# EAGLE schematic 05B-001 (EAGLE 6.3)
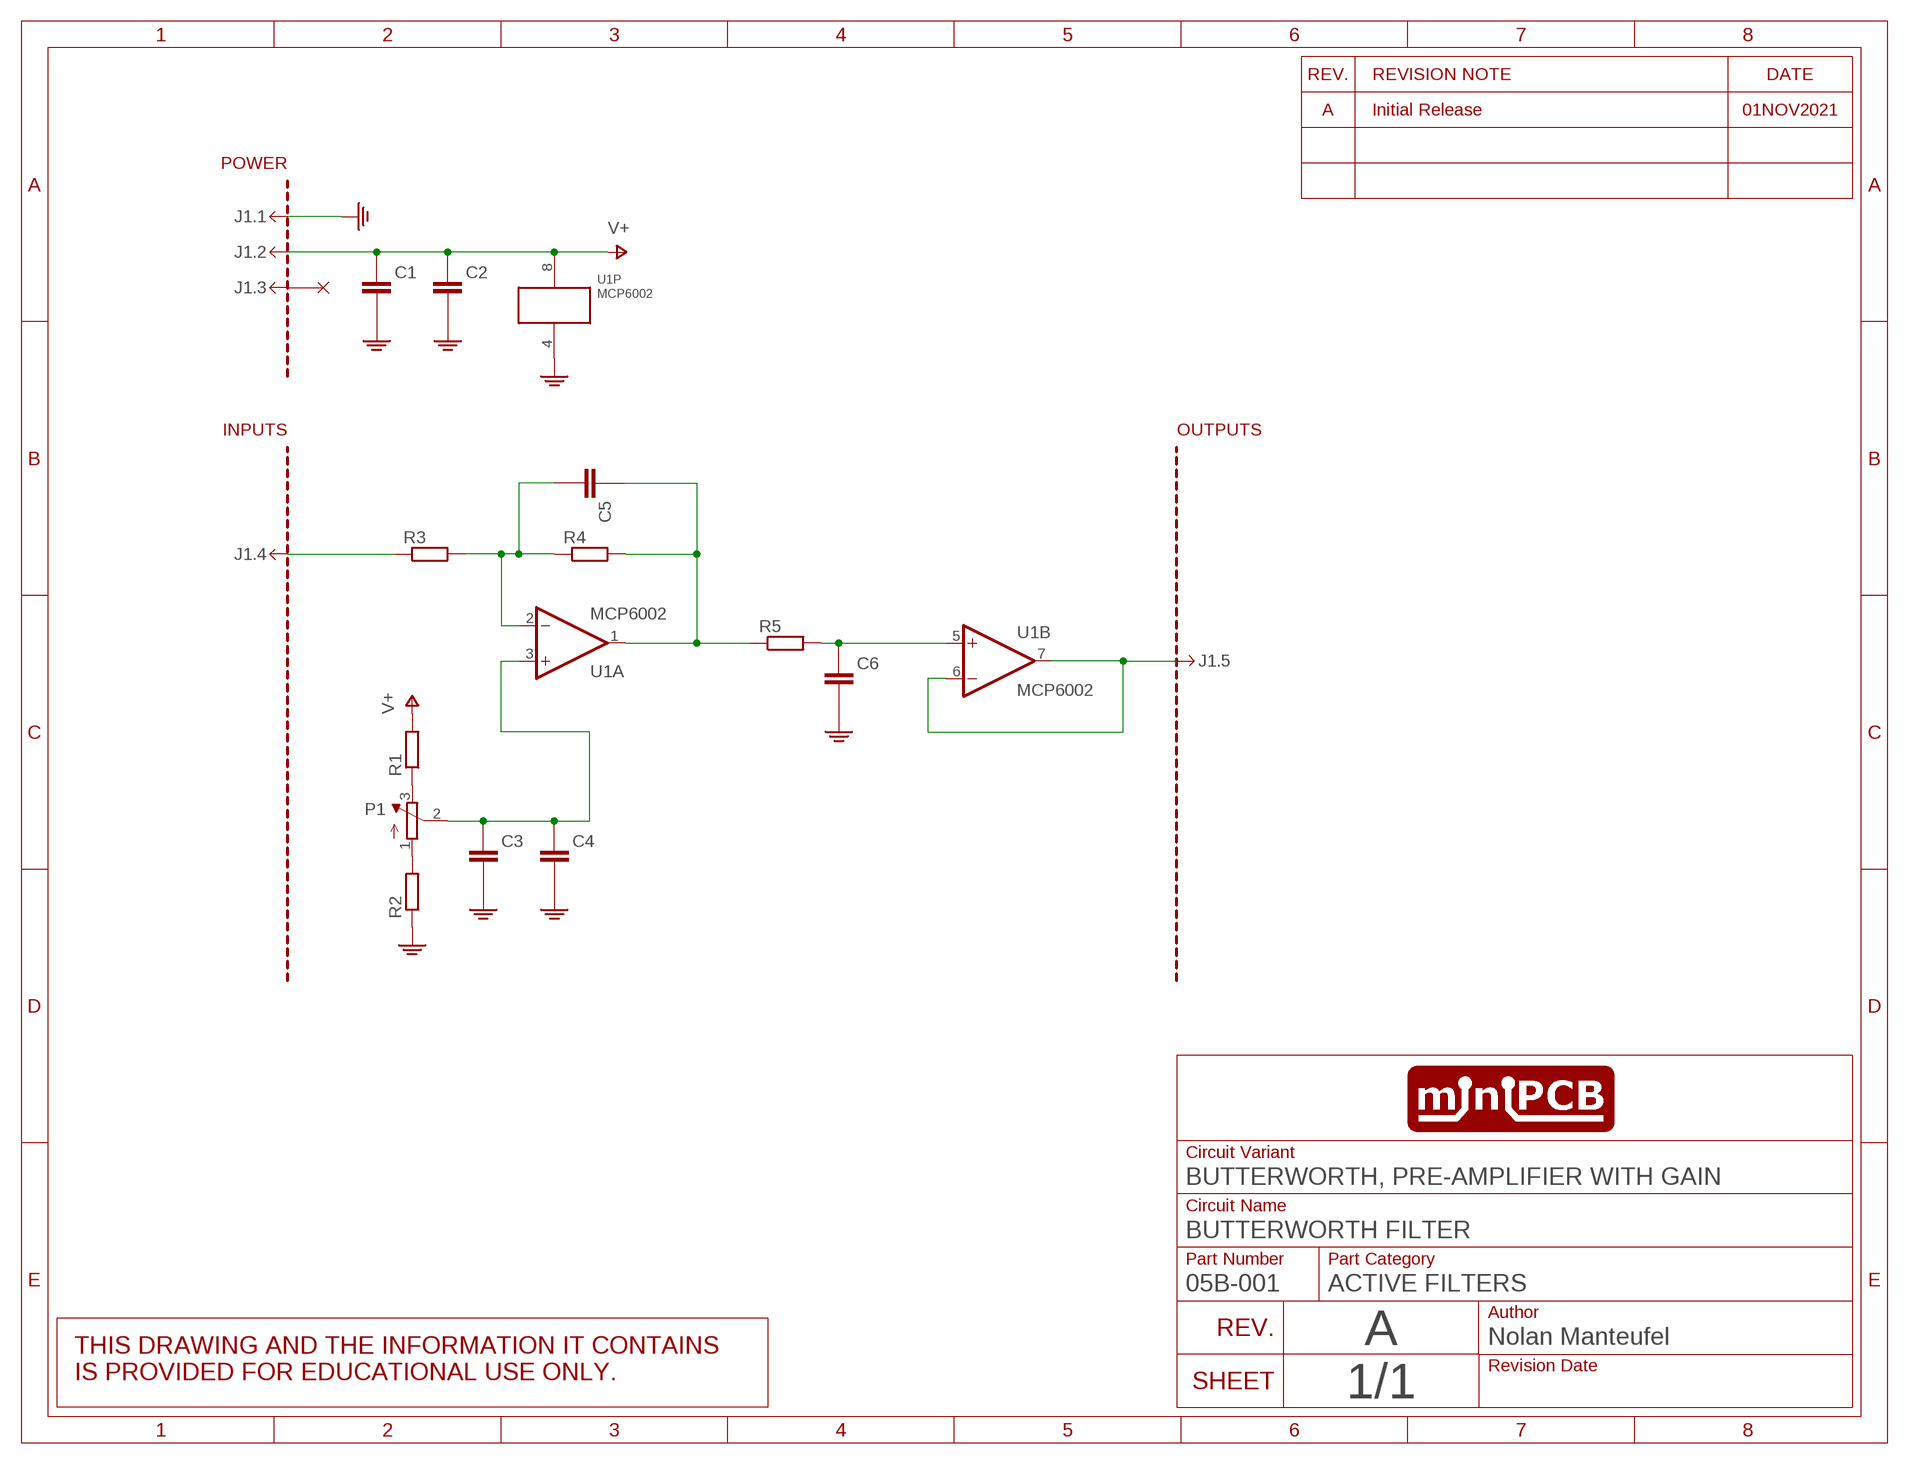
[diagram p0: schematic, sheet 1]
SHEET1 (SCHEMATIC): CIRCUIT_CATEGORY: ACTIVE FILTERS; CIRCUIT_NAME: BUTTERWORTH FILTER; REVISION: A

## Parts
C1  CAPACITORSMD  [C0805]
C2  CAPACITORSMD  [C0805]
C3  CAPACITORSMD  [C0805]
C4  CAPACITORSMD  [C0805]
C5  CAPACITORSMD  [C0805]
C6  CAPACITORSMD  [C0805]
J1.  MINIPCB_5P20X15  [MINIPCB_5P_20X15MM]
P1  TRIMPOT0.100THD  [TRIM_0100]
R1  RESISTORSMD  [R0805]
R2  RESISTORSMD  [R0805]
R3  RESISTORSMD  [R0805]
R4  RESISTORSMD  [R0805]
R5  RESISTORSMD  [R0805]
U1  MCP6002  OPAMP_DUALSMD  [SO08]

## Nets
GND: C1.2(-) C2.2(-) C3.2(-) C4.2(-) C6.2(-) J1..1 R2.1 U1.4(P:V-)
N$1: C5.1(+) R4.2 R5.1 U1.1(A:OUT)
N$2: P1.3(E) R1.1
N$3: J1..4 R3.1
N$4: C5.2(-) R3.2 R4.1 U1.2(A:-IN)
N$5: J1..5 U1.6(B:-IN) U1.7(B:OUT)
N$6: C6.1(+) R5.2 U1.5(B:+IN)
N$7: P1.1(A) R2.2
N$8: C3.1(+) C4.1(+) P1.2(S) U1.3(A:+IN)
V+: C1.1(+) C2.1(+) J1..2 R1.2 U1.8(P:V+)
Unconnected: J1..3

## Notes on the sheet
- 01NOV2021

## Library data of the parts
C1-C6 = minipcb:CAPACITOR
J1. = minipcb:MINIPCB_5P; PART_NUMBER: 05B-001; REVISION: A
P1 = minipcb:TRIMPOT: SMT trimmer potentiometer part number TC33X http://www.ladyada.net/library/eagle
R1-R5 = minipcb:RESISTOR
U1 = minipcb:OPAMP_DUAL: OP AMP